# Altium schematic sheet ESP32.SchDoc
size 381 x 241 mm; SheetNumber: 2; SheetTotal: 2
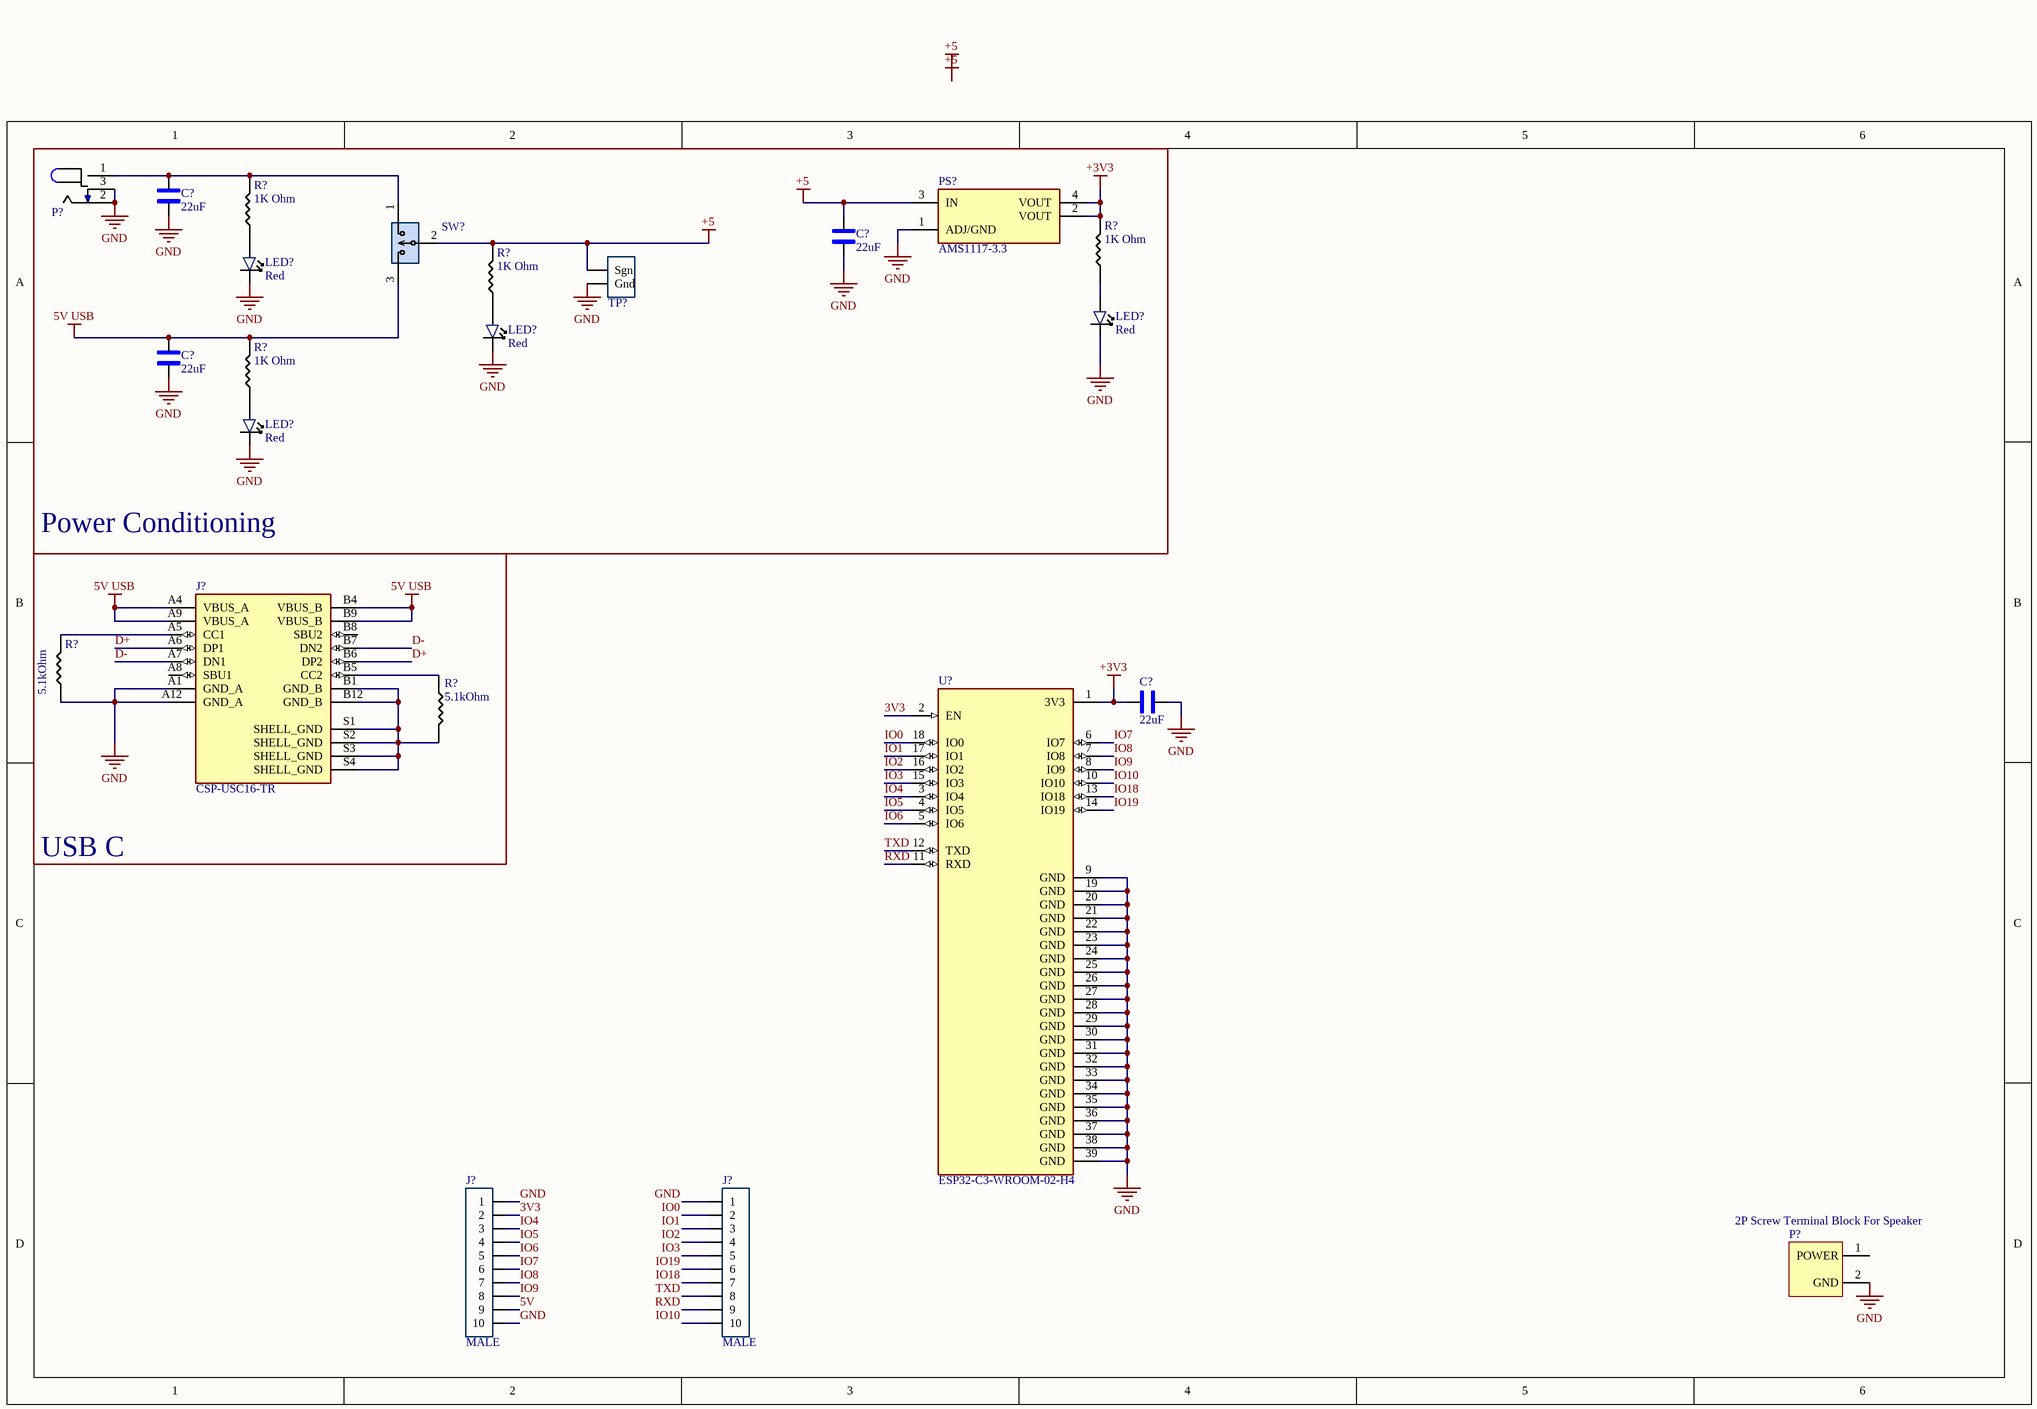
[diagram p0: ESP32.SchDoc]

## Parts
(Parts that share a designator on the sheet are numbered #1, #2 ... from top to bottom, then left to right.)
C?#1  22uF  [1206_Passive_Capacitor]
C?#2  22uF  [1206_Passive_Capacitor]
C?#3  22uF  [1206_Passive_Capacitor]
C?#4  22uF  [1206_Passive_Capacitor]
J?#1  CSP-USC16-TR  [VALCON_CSP-USC16-TR]
J?#2  value MALE  [10_PIN_100MIL-Male]  (hidden comment: MALE 10PIN)
J?#3  value MALE  [10_PIN_100MIL-Male]  (hidden comment: MALE 10PIN)
LED?#1  Red  [LED_1206]
LED?#2  Red  [LED_1206]
LED?#3  Red  [LED_1206]
LED?#4  Red  [LED_1206]
P?#1  Power Jack  [Power_Jack]  (value not drawn)
P?#2  2P Screw Terminal Block For Speaker  [P_Terminal block 3.5mm-pitch]
PS?  AMS1117-3.3  [LDO]
R?#1  value 1K Ohm  [1206_Passive_Resitor]  (hidden comment: 1k)
R?#2  value 1K Ohm  [1206_Passive_Resitor]  (hidden comment: 1k)
R?#3  value 1K Ohm  [1206_Passive_Resitor]  (hidden comment: 1k)
R?#4  value 1K Ohm  [1206_Passive_Resitor]  (hidden comment: 1k)
R?#5  value 5.1kOhm  [1206_Passive_Resitor]  (hidden comment: 510Ohm)
R?#6  value 5.1kOhm  [1206_Passive_Resitor]  (hidden comment: 510Ohm)
SW?  PREC003SAAN-RC  [3_PIN_100mil]  (value not drawn)
TP?  10x Probe TP  [TP10x_Probe]  (value not drawn)
U?  ESP32-C3-WROOM-02-H4  [MODULE_ESP32-C3-WROOM-02-H4]

## Blocks framed on the sheet
Power Conditioning: C?#1-C?#3 LED?#1-LED?#4 P?#1 PS? R?#1-R?#4 SW? TP?

## Nets
5V USB: C?#3.2 J?#1.A4(VBUS_A) J?#1.A9(VBUS_A) J?#1.B4(VBUS_B) J?#1.B9(VBUS_B) R?#4.2 SW?.3
+3V3: C?#4.1 PS?.2(VOUT) PS?.4(VOUT) R?#2.2 U?.1(3V3)
+5: C?#2.1 PS?.3(IN) R?#3.2 SW?.2 TP?.1(Sgn)
GND: C?#1.1 C?#2.2 C?#3.1 C?#4.2 J?#1.A1(GND_A) J?#1.A12(GND_A) J?#2.1 J?#2.10 J?#3.1 LED?#1.2 LED?#2.2 LED?#3.2 LED?#4.2 P?#1.2 P?#1.3 P?#2.2(GND) PS?.1(ADJ/GND) R?#6.1 TP?.2(Gnd) U?.9(GND) U?.19(GND) U?.20(GND) U?.21(GND) U?.22(GND) U?.23(GND) U?.24(GND) U?.25(GND) U?.26(GND) U?.27(GND) U?.28(GND) U?.29(GND) U?.30(GND) U?.31(GND) U?.32(GND) U?.33(GND) U?.34(GND) U?.35(GND) U?.36(GND) U?.37(GND) U?.38(GND) U?.39(GND)
3V3: J?#2.2 U?.2(EN)
5V: J?#2.9
D+: J?#1.A6(DP1) J?#1.B6(DP2)
D-: J?#1.A7(DN1) J?#1.B7(DN2)
IO0: J?#3.2 U?.18(IO0)
IO1: J?#3.3 U?.17(IO1)
IO2: J?#3.4 U?.16(IO2)
IO3: J?#3.5 U?.15(IO3)
IO4: J?#2.3 U?.3(IO4)
IO5: J?#2.4 U?.4(IO5)
IO6: J?#2.5 U?.5(IO6)
IO7: J?#2.6 U?.6(IO7)
IO8: J?#2.7 U?.7(IO8)
IO9: J?#2.8 U?.8(IO9)
IO10: J?#3.10 U?.10(IO10)
IO18: J?#3.7 U?.13(IO18)
IO19: J?#3.6 U?.14(IO19)
RXD: J?#3.9 U?.11(RXD)
TXD: J?#3.8 U?.12(TXD)
NetC?#1_2: C?#1.2 P?#1.1 R?#1.2 SW?.1
NetJ?#1_A5: J?#1.A5(CC1) R?#6.2
NetJ?#1_B1: J?#1.B1(GND_B) J?#1.B12(GND_B) J?#1.S1(SHELL_GND) J?#1.S2(SHELL_GND) J?#1.S3(SHELL_GND) J?#1.S4(SHELL_GND) R?#5.2
NetJ?#1_B5: J?#1.B5(CC2) R?#5.1
NetLED?#1_1: LED?#1.1 R?#1.1
NetLED?#2_1: LED?#2.1 R?#2.1
NetLED?#3_1: LED?#3.1 R?#3.1
NetLED?#4_1: LED?#4.1 R?#4.1

Not connected (* = marked no-connect by the designer): J?#1 A8(SBU1) B8(SBU2); P?#2 1(POWER)

## Notes on the sheet
- USB C
- Labels drawn without touching a wire or pin: +5

## Library data of the parts
C?#1-C?#4 = C_22uF_1206: 22uF ±10% 25V X5R 1206 Multilayer Ceramic Capacitors MLCC - SMD/SMT RoHS; MFR Part #: CL31A226KAHNNNE; Type: basic; LCSC Part#: C12891; Datasheet: https://datasheet.lcsc.com/lcsc/1811031514_Samsung-Electro-Mechanics-CL31A226KAHNNNE_C12891.pdf; Value: 22uF
J?#1 = CSP-USC16-TR: CSP-USC16-TR Valcon USB Type C Surface Mount PCB Socket; SnapEDA_Link: https://www.snapeda.com/parts/CSP-USC16-TR/Valcon/view-part/?ref=snap; MF: Valcon; MP: CSP-USC16-TR; Availability: In Stock; Price: None; Value: *; Check_prices: https://www.snapeda.com/parts/CSP-USC16-TR/Valcon/view-part/?ref=eda; Package: None; Purchase-URL: https://pricing.snapeda.com/search/part/CSP-USC16-TR/?ref=eda
J?#2 J?#3 = JM_10_PIN_MALE: Pin Header 10 1 Straight ，180degrees 2.54mm Through Hole,P=2.54mm Pin Header & Female Header RoHS; LCSC Part#: C124372; Type: Extended; Datasheet: https://datasheet.lcsc.com/szlcsc/1810241611_Ckmtw-Shenzhen-Cankemeng-C124372_C124372.pdf
LED?#1-LED?#4 = LED_RED_1206: Red 621~631nm 1206 Light Emitting Diodes (LED) RoHS; MFR Part #: 15-21/R6C-FQ1R1B/2T; Type: Extended; LCSC Part#: C93133; Datasheet: https://datasheet.lcsc.com/szlcsc/1811151241_Everlight-Elec-15-21-R6C-FQ1R1B-2T_C93133.pdf; Value: Red
P?#1 = P_Power Jack: Power Barrel Connector Jack 2.10mm ID (0.083"), 5.50mm OD (0.217") Through Hole, Right Angle; MFR Part #: PJ-102A; Value: CONN PWR JACK 2X5.5MM SOLDER; Digikey Link: https://www.digikey.com/product-detail/en/PJ-102A/CP-102A-ND/275425/?itemSeq=304982367; LCSC Part#: C136744; Type: Extended
P?#2 = P_Terminal block: Green Straight pin 3.5mm  pitch; P=3.5mm  Screw terminal ROHS; MFR Part #: KF350-3.5-2P; Manufacturer: Cixi Kefa Elec; LCSC Part#: C474892; DataSheet: https://datasheet.lcsc.com/lcsc/2001160007_Cixi-Kefa-Elec-KF350-3-5-2P_C474892.pdf
PS? = PS_AMS_LDO_3v3: LOW DROPOUT REGULATORS(LDO) POSITIVE FIXED 1.3V @ 800MA 15V 3.3V 1A SOT-223 ROHS; Value: IC REG LINEAR 3.3V 800MA SOT223; MFR Part #: AMS1117-3.3; LCSC Part#: C6186; Type: Basic
R?#1-R?#4 = R_1K_1206: CHIP RESISTOR - SURFACE MOUNT 1KOHMS ±1% 1/4W 1206 ROHS; MFR Part #: RNCP1206FTD1K00CT; Digikey Link: https://www.digikey.com/product-detail/en/RNCP1206FTD1K00/RNCP1206FTD1K00CT-ND/2240675/?itemSeq=304982373; LCSC Part#: C4410; Type: Basic
R?#5 R?#6 = R_510Ohm_1206: 510Ω ±5% 0.25W ±100ppm/℃ 1206 Chip Resistor - Surface Mount RoHS; MFR Part #: 1206W4J0511T5E; LCSC Part#: C25386; Type: Extended; Datasheet: https://datasheet.lcsc.com/lcsc/1810301437_UNI-ROYAL-Uniroyal-Elec-1206W4J0511T5E_C25386.pdf
SW? = SW_3Pin_100mil_Switch: Connector Header Through Hole 3 position 0.100" (2.54mm); Value: CONN HEADER VERT 3POS 2.54MM; Digikey Link: https://www.digikey.com/product-detail/en/PREC003SAAN-RC/S1012EC-03-ND/2774851/?itemSeq=304982371; MFR Part #: PREC003SAAN-RC; Type: Extended; LCSC Part#: C49257
TP? = TP_10x_Probe: Test Point 300 mil centers
U? = ESP32-C3-WROOM-02-H4: WiFi Modules (802.11) (Engineering Samples) SMD module, ESP32-C3, 4MB SPI flash, PCB antenna, -40 C +105 C; MF: Espressif Systems; MP: ESP32-C3-WROOM-02-H4; Package: Package; Purchase-URL: https://pricing.snapeda.com/search/part/ESP32-C3-WROOM-02-H4/?ref=eda; Check_prices: https://www.snapeda.com/parts/ESP32-C3-WROOM-02-H4/Espressif+Systems/view-part/?ref=eda; SnapEDA_Link: https://www.snapeda.com/parts/ESP32-C3-WROOM-02-H4/Espressif+Systems/view-part/?ref=snap; Price: None; Availability: In Stock; Value: *